# EAGLE design SensorThing (EAGLE 7.5.0)
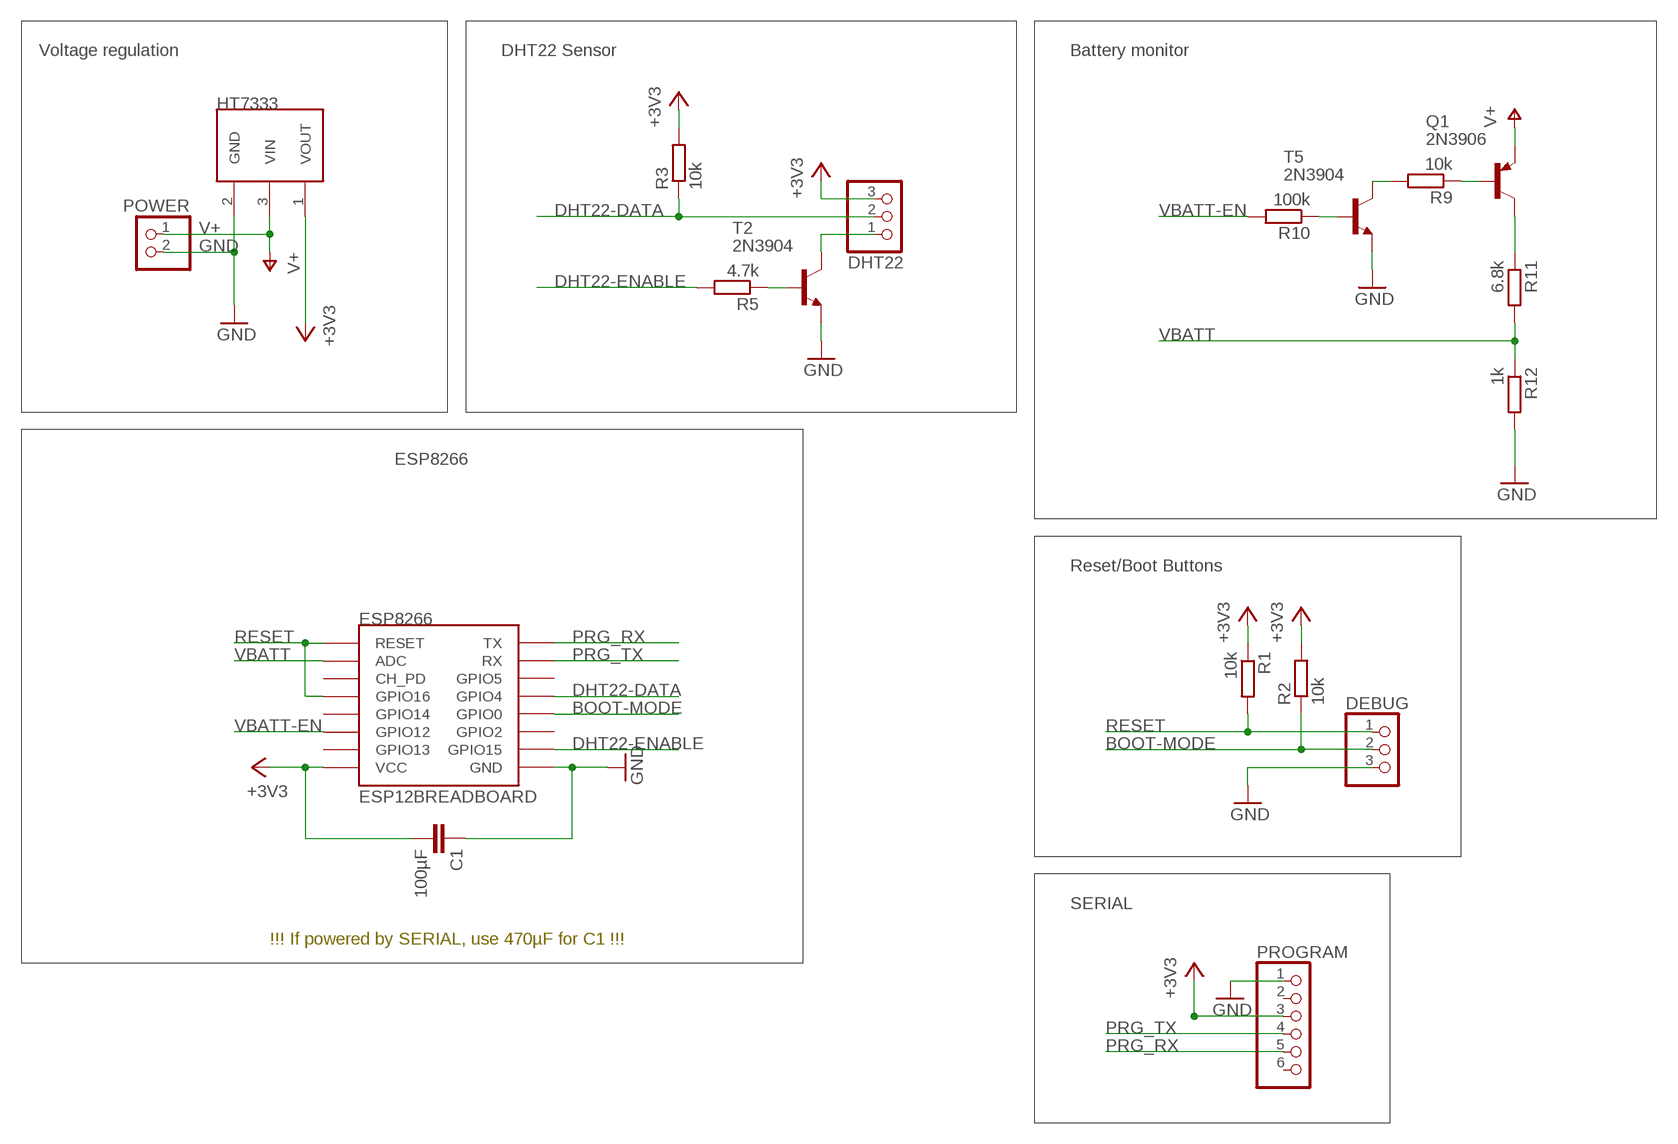
[diagram p0: schematic, sheet 1]

## Parts
C1  100µF  C-EU025-024X044  [C025-024X044]
DEBUG  PINHD-1X3/90  [1X03/90]
DHT22  PINHD-1X3/90  [1X03/90]
ESP8266  ESP12BREADBOARD  [ESP12E-BREADBOARD]
HT7333  HT73XX  [SOT89-R]
POWER  PINHD-1X2/90  [1X02/90]
PROGRAM  PINHD-1X6/90  [1X06/90]
Q1  2N3906  [TO92]
R1  10k  R-EU_0204/7  [0204/7]
R2  10k  R-EU_0204/7  [0204/7]
R3  10k  R-EU_0204/7  [0204/7]
R5  4.7k  R-EU_M0805  [M0805]
R9  10k  R-EU_0204/7  [0204/7]
R10  100k  R-EU_M0805  [M0805]
R11  6.8k  R-EU_0204/7  [0204/7]
R12  1k  R-EU_M0805  [M0805]
T2  2N3904  [TO92]
T5  2N3904  [TO92]

## Nets
+3V3: C1.2 DHT22.3 ESP8266.8(VCC) HT7333.1(VOUT) PROGRAM.3 R1.1 R2.2 R3.2
BOOT-MODE: DEBUG.2 ESP8266.12(GPIO0) R2.1
DHT22-DATA: DHT22.2 ESP8266.13(GPIO4) R3.1
DHT22-ENABLE: ESP8266.10(GPIO15) R5.2
GND: C1.1 DEBUG.3 ESP8266.9(GND) HT7333.2(GND) POWER.2 PROGRAM.1 R12.2 T2.3(E) T5.3(E)
N$1: R5.1 T2.2(B)
N$2: DHT22.1 T2.1(C)
N$5: R9.2 T5.1(C)
N$7: R10.1 T5.2(B)
N$8: Q1.1(C) R11.1
N$9: Q1.2(B) R9.1
PRG_RX: ESP8266.16(TX) PROGRAM.5
PRG_TX: ESP8266.15(RX) PROGRAM.4
RESET: DEBUG.1 ESP8266.1(RESET) ESP8266.4(GPIO16) R1.2
V+: HT7333.3(VIN) POWER.1 Q1.3(E)
VBATT: ESP8266.2(ADC) R11.2 R12.1
VBATT-EN: ESP8266.6(GPIO12) R10.2
Unconnected: ESP8266.3(CH_PD) ESP8266.5(GPIO14) ESP8266.7(GPIO13) ESP8266.11(GPIO2) ESP8266.14(GPIO5) PROGRAM.2 PROGRAM.6

## Notes on the sheet
- Voltage regulation | DHT22 Sensor | Battery monitor
- ESP8266
- Reset/Boot Buttons
- SERIAL
- !!! If powered by SERIAL, use 470µF for C1 !!!

## Library data of the parts
C1 = resistor:C-EU: CAPACITOR, European symbol
DEBUG DHT22 = pinhead:PINHD-1X3: PIN HEADER
ESP8266 = esp8266modules:ESP12: ESP8266 Wifi module 12
HT7333 = VoltageRegulators:HT73XX
POWER = pinhead:PINHD-1X2: PIN HEADER
PROGRAM = pinhead:PINHD-1X6: PIN HEADER
Q1 = transistor-pnp:2N3906: PNP Transistor
R1-R3 R5 R9-R12 = resistor:R-EU_: RESISTOR, European symbol
T2 T5 = transistor:2N3904: NPN TRANSISTOR

## Board
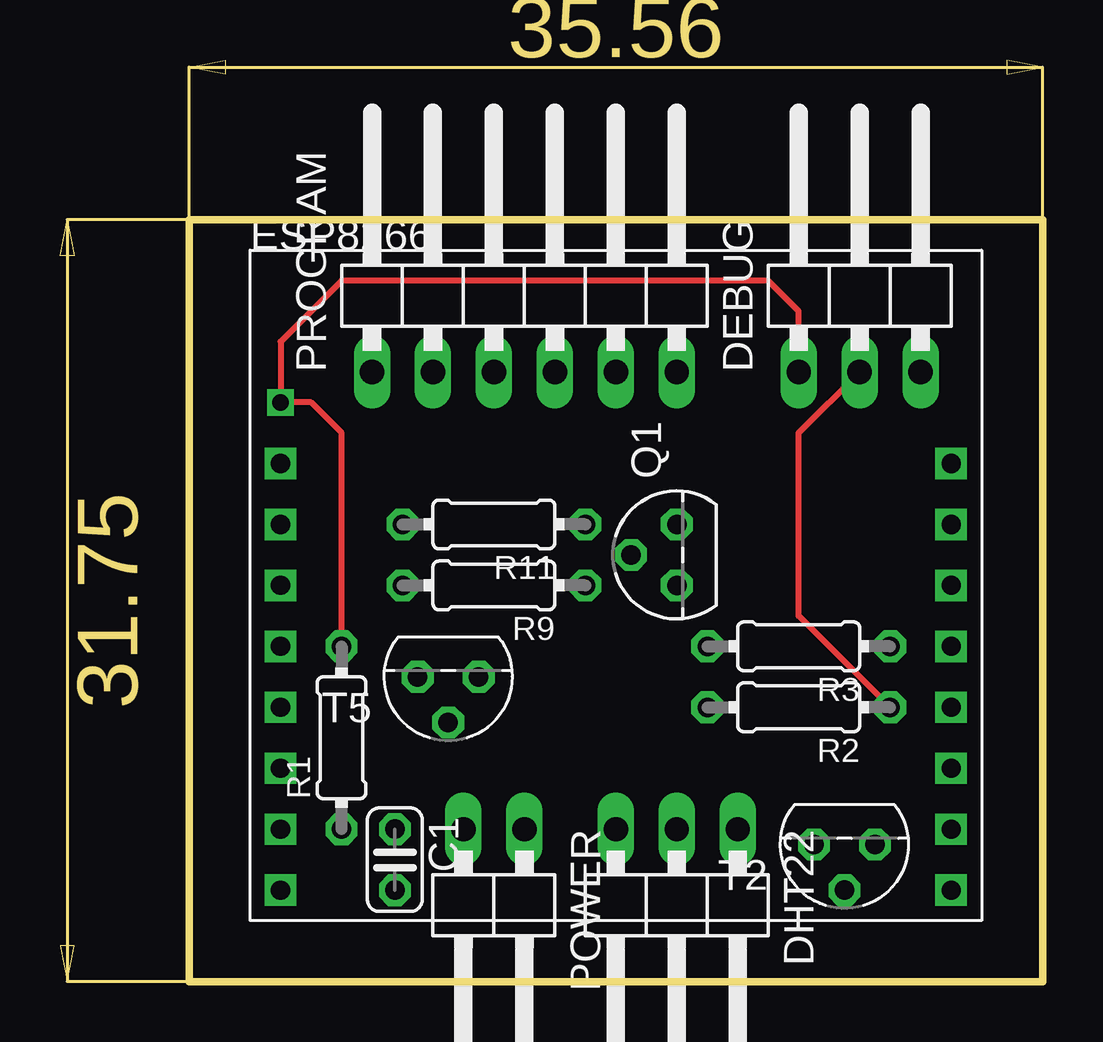
[diagram p1: board, top side]
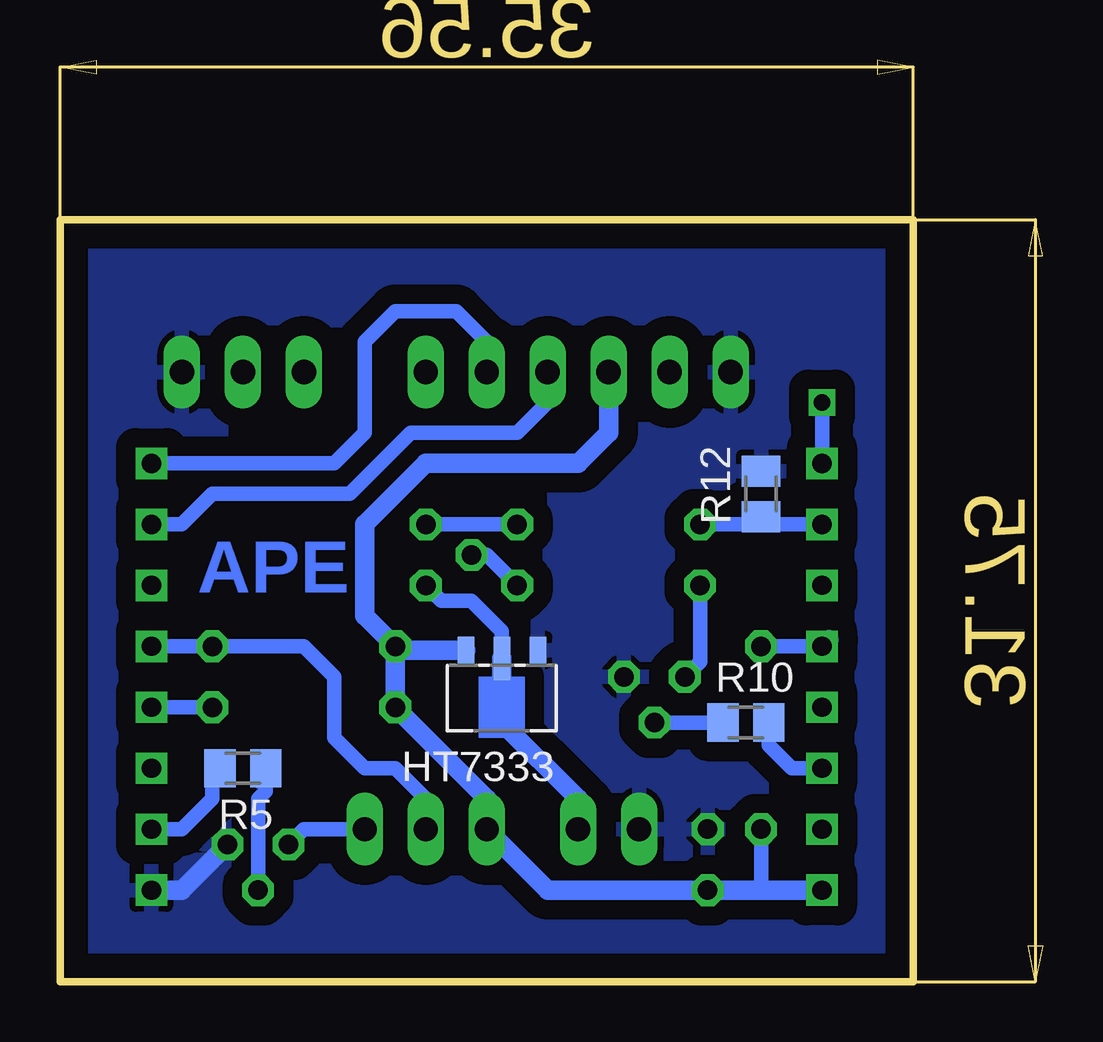
[diagram p2: board, bottom side, seen from below]

Size 35.56 x 31.75 mm. Coordinates in mm from the lower left corner, seen from the top.
Outline: 0,31.75 0,0 35.56,0 35.56,31.75 0,31.75
Copper layers (1*16): Top 0.035mm / dielectric 1.5mm / Bottom 0.035mm
Design rules "default": minimum track width 10mil, minimum drill 24mil, track to track 8mil, track to pad 8mil, pad to pad 8mil, via to via 8mil, smd to smd 8mil, copper to edge 40mil, drill to drill 8mil, minimum pad ring 10mil, minimum via ring 8mil, stop-mask expansion 4mil, vias tented up to drill 0mil, thermal gap 10mil

### Footprints (pad centres in the part's own frame; a part is rotated, then mirrored left to right if it is on the bottom)
C025-024X044 = drill 0.813 octagon: 1 -1.27,0; 2 1.27,0
1X03/90 = drill 1.016 long: 1 -2.54,-3.81; 2 0,-3.81; 3 2.54,-3.81
ESP12E-BREADBOARD = drill 0.8 square: 1 -12.7,17.78; 2 -12.7,15.24; 3 -12.7,12.7; 4 -12.7,10.16; 5 -12.7,7.62; 6 -12.7,5.08; 7 -12.7,2.54; 8 -12.7,0; 9 15.24,0; 10 15.24,2.54; 11 15.24,5.08; 12 15.24,7.62; 13 15.24,10.16; 14 15.24,12.7; 15 15.24,15.24; 16 15.24,17.78
SOT89-R = smd 0.7 x 1.1: 1 1.5,-1.75; 2 -1.5,-1.75 | smd 0.7 x 1.8: 3 0,-1.4
1X02/90 = drill 1.016 long: 1 -1.27,-3.81; 2 1.27,-3.81
1X06/90 = drill 1.016 long: 1 -6.35,-3.81; 2 -3.81,-3.81; 3 -1.27,-3.81; 4 1.27,-3.81; 5 3.81,-3.81; 6 6.35,-3.81
TO92 = drill 0.813 octagon: 1 1.27,0; 2 0,1.905; 3 -1.27,0
0204/7 = drill 0.813 octagon: 1 -3.81,0; 2 3.81,0
M0805 = smd 1.3 x 1.6: 1 -0.95,0; 2 0.95,0

### Placement (x,y rotation side)
C1  8.57,5.08 270 top
DEBUG  27.94,29.21 0 top
DHT22  20.32,2.54 180 top
ESP8266  16.51,3.81 0 top
HT7333  17.14,12.06 180 bottom
POWER  12.7,2.54 180 top
PROGRAM  13.97,29.21 0 top
Q1  20.32,17.78 90 top
R1  6.35,10.16 90 top
R2  25.4,11.43 180 top
R3  25.4,13.97 180 top
R5  27.94,8.89 180 bottom
R9  12.7,16.51 180 top
R10  6.99,10.79 0 bottom
R11  12.7,19.05 180 top
R12  6.35,20.32 90 bottom
T2  27.3,5.71 180 top
T5  10.79,12.7 180 top

### Tracks (layer width: path | path; a pad name or v marks a point on that pad's centre or on a via)
+3V3
  Bottom 0.61: 6.35,3.81 R1.1
  Bottom 0.813: R3.2 R2.2 17.78,7.62 DHT22.3 15.24,3.81 C1.2 6.35,3.81 ESP8266.8 | PROGRAM.3 12.7,22.86 13.97,21.59 20.32,21.59 22.86,19.05 22.86,15.24 R3.2 | HT7333.1 21.43,13.81 R3.2
BOOT-MODE
  Top 0.254: R2.1 25.4,15.24 25.4,22.86 DEBUG.2
  Bottom 0.61: R2.1 ESP8266.12
DHT22-DATA
  Bottom 0.61: DHT22.2 20.32,7.62 21.59,8.89 22.86,8.89 24.13,10.16 24.13,12.7 25.4,13.97 R3.1 ESP8266.13
DHT22-ENABLE
  Bottom 0.61: R5.2 29.21,8.57 29.21,7.62 30.48,6.35 ESP8266.10
GND
  Bottom 0.813: T2.3 30.48,3.81 ESP8266.9
  pour Bottom (isolate 0.813): 1.27,30.48 1.27,1.27 34.29,1.27 34.29,30.48
N$1
  Bottom 0.406: 27.3,8.26 26.99,8.26 R5.1
  Bottom 0.61: T2.2 27.3,7.62 26.99,7.93 R5.1
N$2
  Bottom 0.61: T2.1 25.4,6.35 DHT22.1
N$5
  Bottom 0.61: T5.1 8.89,13.34 R9.2
N$7
  Bottom 0.61: R10.1 T5.2
N$8
  Bottom 0.61: R11.1 Q1.1
N$9
  Bottom 0.61: R9.1 17.78,17.78 Q1.2
PRG_RX
  Bottom 0.61: PROGRAM.5 17.78,26.67 19.05,27.94 21.59,27.94 22.86,26.67 22.86,22.86 24.13,21.59 ESP8266.16
PRG_TX
  Bottom 0.61: PROGRAM.4 15.24,24.13 16.51,22.86 20.95,22.86 23.5,20.32 29.21,20.32 30.48,19.05 ESP8266.15
RESET  (via drill 0.7)
  Top 0.254: DEBUG.1 25.4,27.94 24.13,29.21 6.35,29.21 3.81,26.67 v3.81,24.13 5.08,24.13 6.35,22.86 R1.2
  Bottom 0.61: R1.2 ESP8266.4 | ESP8266.1 v3.81,24.13
  Bottom 0.813: 3.53,14.25 ESP8266.4
V+
  Bottom 0.61: HT7333.3 17.14,14.61 18.41,15.88 19.68,15.88 Q1.3
  Bottom 0.813: POWER.1 13.97,7.62 17.14,10.79 HT7333.3
VBATT
  Bottom 0.406: R12.1 6.03,19.05
  Bottom 0.61: R11.2 6.67,19.05 R12.1 6.35,19.05 ESP8266.2
VBATT-EN
  Bottom 0.61: ESP8266.6 5.08,8.89 6.04,9.85 R10.2

### Text on the board
Bottom: APE